# Altium schematic sheet RTC_SD_HDMI.SchDoc
size A3
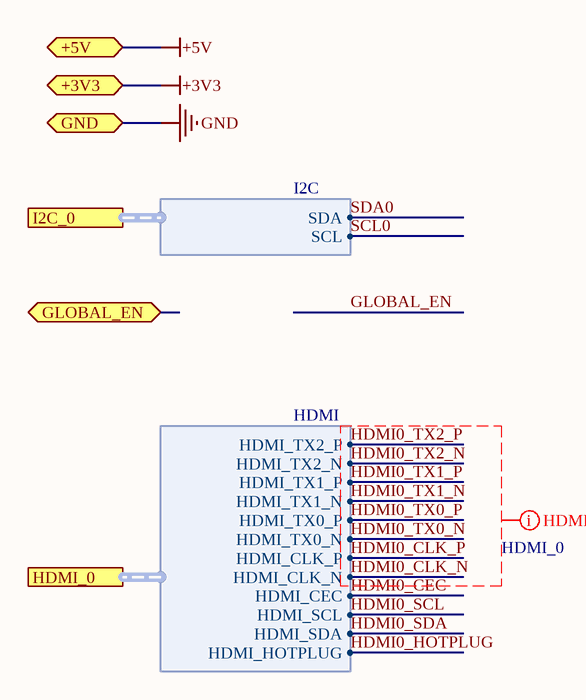
[diagram p0: RTC_SD_HDMI.SchDoc]

## Ports
+3V3 (bidir), +5V (bidir), GLOBAL_EN (bidir), GND (bidir), HDMI_0 (harness HDMI), I2C_0 (harness I2C)

## Harnesses
HDMI: HDMI_CLK_N, HDMI_TX2_P, HDMI_CLK_P, HDMI_TX0_N, HDMI_TX2_N, HDMI_TX1_P, HDMI_TX1_N, HDMI_TX0_P, HDMI_CEC, HDMI_SCL, HDMI_SDA, HDMI_HOTPLUG
I2C: SCL, SDA

## Nets
+3V3: port +3V3
+5V: port +5V
GND: port GND
HDMI0_CEC: port HDMI_0.HDMI_CEC
HDMI0_CLK_N: port HDMI_0.HDMI_CLK_N
HDMI0_CLK_P: port HDMI_0.HDMI_CLK_P
HDMI0_HOTPLUG: port HDMI_0.HDMI_HOTPLUG
HDMI0_SCL: port HDMI_0.HDMI_SCL
HDMI0_SDA: port HDMI_0.HDMI_SDA
HDMI0_TX0_N: port HDMI_0.HDMI_TX0_N
HDMI0_TX0_P: port HDMI_0.HDMI_TX0_P
HDMI0_TX1_N: port HDMI_0.HDMI_TX1_N
HDMI0_TX1_P: port HDMI_0.HDMI_TX1_P
HDMI0_TX2_N: port HDMI_0.HDMI_TX2_N
HDMI0_TX2_P: port HDMI_0.HDMI_TX2_P
SCL0: port I2C_0.SCL
SDA0: port I2C_0.SDA

## Layout directives
net class HDMI_0: HDMI0_CLK_N, HDMI0_CLK_P, HDMI0_TX0_N, HDMI0_TX0_P, HDMI0_TX1_N, HDMI0_TX1_P, HDMI0_TX2_N, HDMI0_TX2_P

## Notes on the sheet
- Tarih/Date
- Kont/Check
- Onay/Appr
- Haz/Prep
- Ortam/Env
- Sayfa/Sht
- Form
- /
- Deg Tarihi/Chng Date
- Deg Onay/Chng Appr
- Rev
- All rights reserved. No part of this document may be reproduced or transmitted in any form or by any means, electronic, mechanical, photocopying, recording, or otherwise, without prior written permission of